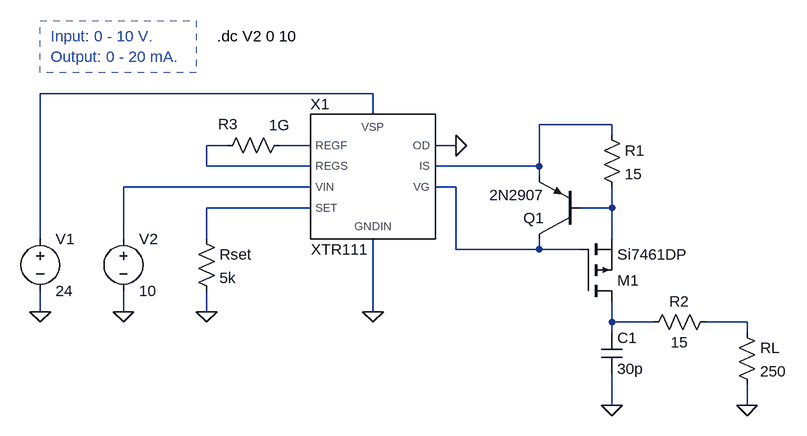
[diagram p0: schematic XTR111 Simulation.asc]
XTR111 Simulation.asc, the LTspice schematic file:
Version 4
SHEET 1 880 680
WIRE 224 64 -288 64
WIRE 224 96 224 64
WIRE 592 112 480 112
WIRE 592 128 592 112
WIRE 0 144 -32 144
WIRE 128 144 80 144
WIRE 352 144 320 144
WIRE -32 176 -32 144
WIRE 128 176 -32 176
WIRE 480 176 480 112
WIRE 480 176 320 176
WIRE 480 192 480 176
WIRE 128 208 -160 208
WIRE 352 208 320 208
WIRE 128 240 -32 240
WIRE 592 240 592 208
WIRE 592 240 544 240
WIRE -288 288 -288 64
WIRE -160 288 -160 208
WIRE -32 288 -32 240
WIRE 592 288 592 240
WIRE 352 304 352 208
WIRE 480 304 480 288
WIRE 480 304 352 304
WIRE 544 304 480 304
WIRE -288 400 -288 368
WIRE -160 400 -160 368
WIRE -32 400 -32 368
WIRE 224 400 224 288
WIRE 592 416 592 384
WIRE 656 416 592 416
WIRE 800 416 736 416
WIRE 592 432 592 416
WIRE 800 432 800 416
WIRE 592 544 592 496
WIRE 800 544 800 512
FLAG 592 544 0
FLAG 800 544 0
FLAG 224 400 0
FLAG -32 400 0
FLAG -288 400 0
FLAG -160 400 0
FLAG 352 144 0
SYMBOL pnp 544 288 R180
SYMATTR InstName Q1
SYMATTR Value 2N2907
SYMBOL pmos 544 384 M180
SYMATTR InstName M1
SYMATTR Value Si7461DP
SYMBOL res 576 112 R0
SYMATTR InstName R1
SYMATTR Value 15
SYMBOL cap 576 432 R0
SYMATTR InstName C1
SYMATTR Value 30p
SYMBOL res 640 432 R270
WINDOW 0 32 56 VTop 2
WINDOW 3 0 56 VBottom 2
SYMATTR InstName R2
SYMATTR Value 15
SYMBOL res 784 416 R0
SYMATTR InstName RL
SYMATTR Value 250
SYMBOL voltage -288 272 R0
WINDOW 123 0 0 Left 2
WINDOW 39 0 0 Left 2
SYMATTR InstName V1
SYMATTR Value 24
SYMBOL voltage -160 272 R0
WINDOW 123 0 0 Left 2
WINDOW 39 0 0 Left 2
SYMATTR InstName V2
SYMATTR Value 10
SYMBOL res -48 272 R0
SYMATTR InstName Rset
SYMATTR Value 5k
SYMBOL res -16 160 R270
WINDOW 0 33 17 VTop 2
WINDOW 3 32 96 VTop 2
SYMATTR InstName R3
SYMATTR Value 1G
SYMBOL XTR111 224 192 R0
SYMATTR InstName X1
TEXT -16 -24 Left 2 !.dc V2 0 10
TEXT -272 -24 Left 2 ;Input: 0 - 10 V.\nOutput: 0 - 20 mA.
RECTANGLE Normal -48 32 -288 -48 2

The netlist it stands for:
* XTR111 Simulation.asc
Q1 N006 N008 N002 0 2N2907
M1 N009 N006 N008 N008 Si7461DP
R1 N002 N008 15
C1 N009 0 30p
R2 N009 N010 15
RL N010 0 250
V1 N001 0 24
V2 N005 0 10
Rset N007 0 5k
R3 N003 N004 1G
XX1 N004 N003 N005 N007 0 N002 N006 N001 0 XTR111  ; pins REGF REGS VIN SET OD IS VG VSP GNDIN
.model NPN NPN
.model PNP PNP
.lib standard.bjt
.model NMOS NMOS
.model PMOS PMOS
.lib standard.mos
.dc V2 0 10
* Input: 0 - 10 V.
* Output: 0 - 20 mA.
.backanno
.end